# Altium project ScYPlEj6.PrjPCB
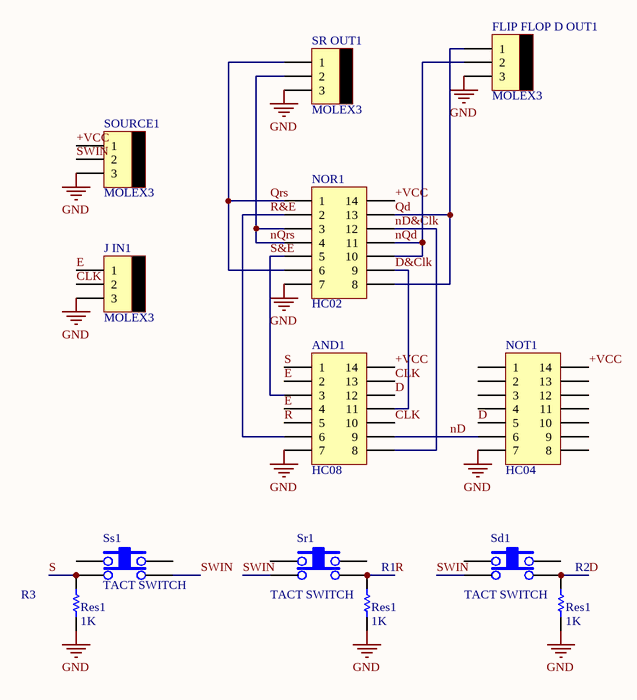
[diagram p0: ShEj6.SchDoc]
1 sheet, 13 parts. Net scope: global (net labels, ports and power ports of the same name join across sheets).
Board file: PlacaEj6.PcbDoc

## Sheet ShEj6.SchDoc
size A

### Parts
AND1  HC08  [DIP14]
FLIP_FLOP_D_OUT1  MOLEX3  [MOLEX3]
J_IN1  MOLEX3  [MOLEX3]
NOR1  HC02  [DIP14]
NOT1  HC04  [DIP14]
R1  Res1  value 1K  [AXIAL-0.3]
R2  Res1  value 1K  [AXIAL-0.3]
R3  Res1  value 1K  [AXIAL-0.3]
Sd1  TACT SWITCH  [TACTSWITCH]
SOURCE1  MOLEX3  [MOLEX3]
Sr1  TACT SWITCH  [TACTSWITCH]
SR_OUT1  MOLEX3  [MOLEX3]
Ss1  TACT SWITCH  [TACTSWITCH]

### Nets
GND: AND1.7 FLIP_FLOP_D_OUT1.3 J_IN1.3 NOR1.7 NOT1.7 R1.1 R2.1 R3.1 SOURCE1.3 SR_OUT1.3
+VCC: AND1.14 NOR1.14 NOT1.14 SOURCE1.1
CLK: AND1.10 AND1.13 J_IN1.2
D: AND1.12 NOT1.5 R2.2 Sd1.4
D&Clk: AND1.11 NOR1.9
E: AND1.2 AND1.4 J_IN1.1
nD: AND1.9 NOT1.6
nD&Clk: AND1.8 NOR1.12
nQd: FLIP_FLOP_D_OUT1.2 NOR1.10 NOR1.11
nQrs: NOR1.3 NOR1.4 SR_OUT1.2
Qd: FLIP_FLOP_D_OUT1.1 NOR1.8 NOR1.13
Qrs: NOR1.1 NOR1.6 SR_OUT1.1
R: AND1.5 R1.2 Sr1.4
R&E: AND1.6 NOR1.2
S: AND1.1 R3.2 Ss1.4
S&E: AND1.3 NOR1.5
SWIN: Sd1.2 SOURCE1.2 Sr1.2 Ss1.2

Not connected (* = marked no-connect by the designer): NOT1 1 2 3 4 8 9 10 11 12 13; Sd1 1 3; Sr1 1 3; Ss1 1 3

### Library data of the parts
AND1 NOR1 NOT1 = IC_DIP14
R1-R3 = Res1: Resistor; Published: 8-Jun-2000; LatestRevisionDate: 17-Jul-2002; LatestRevisionNote: Re-released for DXP Platform.; PackageReference: AXIAL-0.3; Publisher: Altium Limited; PackageDescription: Axial Device, Thru-Hole; 2 Leads; 0.3 in Pin Spacing